# EAGLE design HS(LED CONTROLLER)V1 (EAGLE 8.3.0)
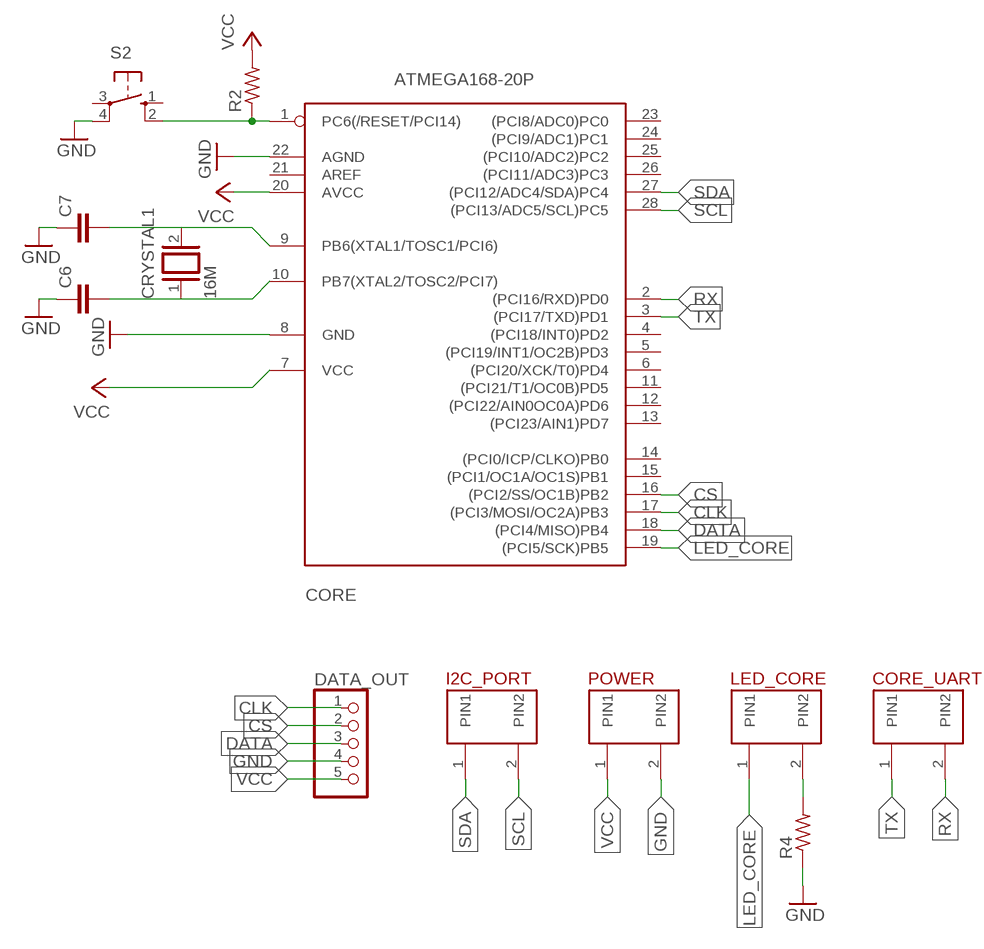
[diagram p0: schematic, sheet 1]

## Parts
C6  C-EU025-024X044  [C025-024X044]
C7  C-EU025-024X044  [C025-024X044]
CORE  ATMEGA168-20P  [DIL28-3]
CORE_UART  7325  [2.54MM]
CRYSTAL1  16M  XTAL/S  [QS]
DATA_OUT  PINHD-1X5/90  [1X05/90]
I2C_PORT  7325  [2.54MM]
LED_CORE  7325  [2.54MM]
POWER  7325  [2.54MM]
R2  R-US_0207/10  [0207/10]
R4  R-US_0207/10  [0207/10]
S2  10-XX  [B3F-10XX]

## Nets
CLK: CORE.17((PCI3/MOSI/OC2A)PB3) DATA_OUT.1
CS: CORE.16((PCI2/SS/OC1B)PB2) DATA_OUT.2
DATA: CORE.18((PCI4/MISO)PB4) DATA_OUT.3
GND: C6.1 C7.1 CORE.8(GND) CORE.22(AGND) DATA_OUT.4 POWER.2(PIN2) R4.1 S2.4(P1)
LED_CORE: CORE.19((PCI5/SCK)PB5) LED_CORE.1(PIN1)
N$5: LED_CORE.2(PIN2) R4.2
N$6: C7.2 CORE.9(PB6(XTAL1/TOSC1/PCI6)) CRYSTAL1.2
N$7: C6.2 CORE.10(PB7(XTAL2/TOSC2/PCI7)) CRYSTAL1.1
N$8: CORE.1(PC6(/RESET/PCI14)) R2.1 S2.2(S1)
RX: CORE.2((PCI16/RXD)PD0) CORE_UART.2(PIN2)
SCL: CORE.28((PCI13/ADC5/SCL)PC5) I2C_PORT.2(PIN2)
SDA: CORE.27((PCI12/ADC4/SDA)PC4) I2C_PORT.1(PIN1)
TX: CORE.3((PCI17/TXD)PD1) CORE_UART.1(PIN1)
VCC: CORE.7(VCC) CORE.20(AVCC) DATA_OUT.5 POWER.1(PIN1) R2.2
Unconnected: CORE.4((PCI18/INT0)PD2) CORE.5((PCI19/INT1/OC2B)PD3) CORE.6((PCI20/XCK/T0)PD4) CORE.11((PCI21/T1/OC0B)PD5) CORE.12((PCI22/AIN0OC0A)PD6) CORE.13((PCI23/AIN1)PD7) CORE.14((PCI0/ICP/CLKO)PB0) CORE.15((PCI1/OC1A/OC1S)PB1) CORE.21(AREF) CORE.23((PCI8/ADC0)PC0) CORE.24((PCI9/ADC1)PC1) CORE.25((PCI10/ADC2)PC2) CORE.26((PCI11/ADC3)PC3) S2.1(S) S2.3(P)

## Library data of the parts
C6 C7 = resistor:C-EU: CAPACITOR, European symbol
CORE = adafruit:ATMEGA168*P: MICROCONTROLLER 16 kBytes FLASH 1 kBytes SRAM 512 Bytes EEPROM USART 8-channel 10 bit ADC
CORE_UART I2C_PORT LED_CORE POWER = pin header:7325
CRYSTAL1 = special:XTAL/S: CRYSTAL
DATA_OUT = pinhead:PINHD-1X5: PIN HEADER
R2 R4 = adafruit:R-US_: RESISTOR, American symbol
S2 = switch-omron:10-XX: OMRON SWITCH; MPN: B3F-1000; OC_FARNELL: 176432; OC_NEWARK: 36M3542

## Net classes
0 default: width 0.15 mm, drill 0.3 mm, clearance 0.15 mm

## Board
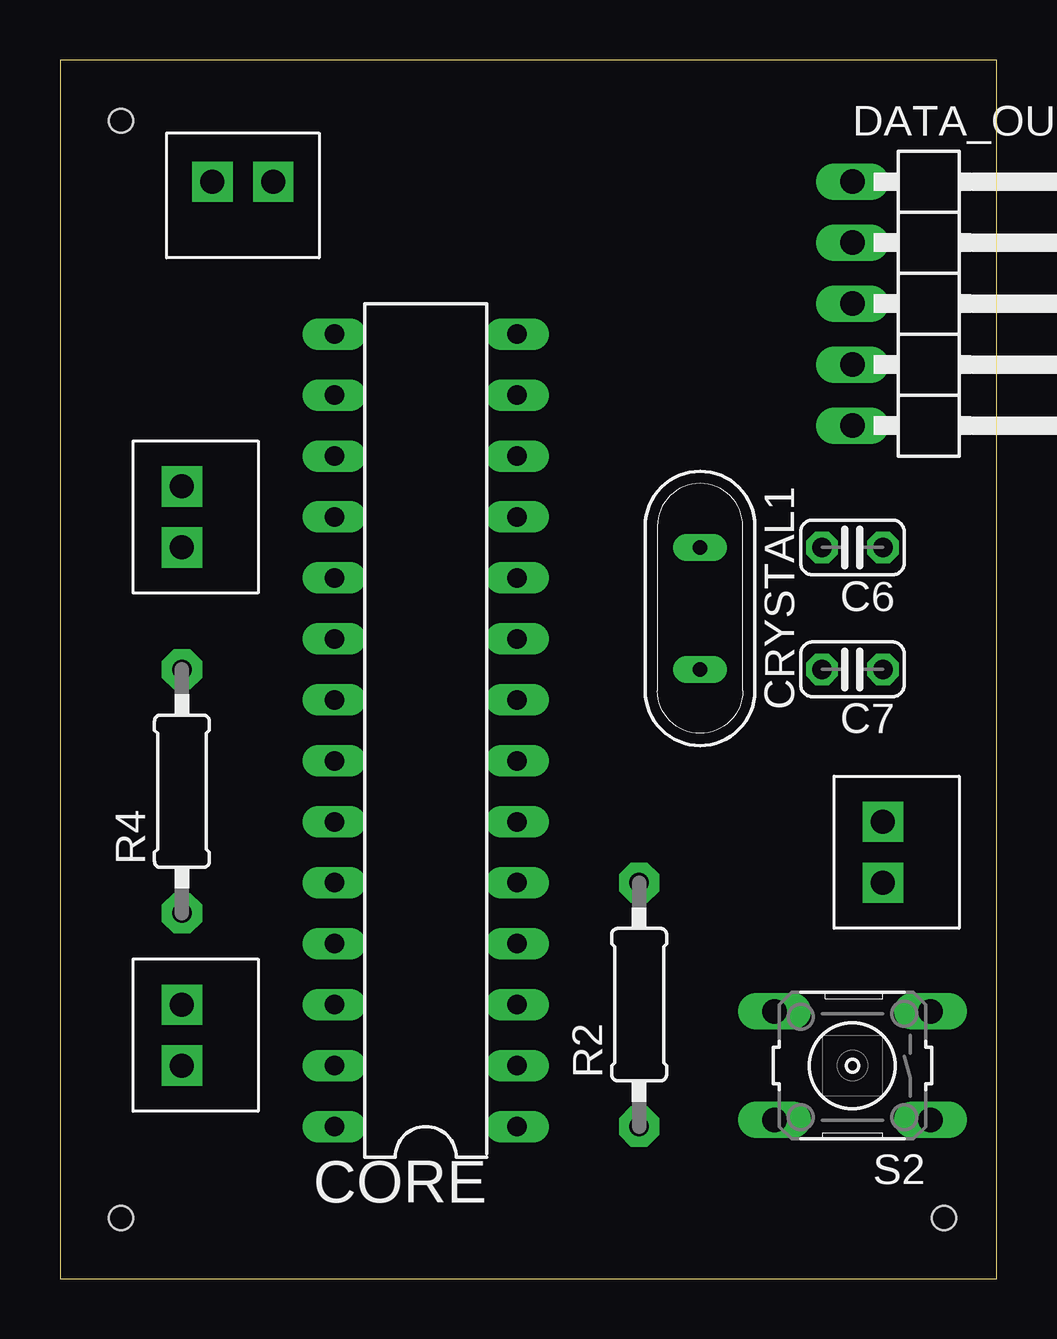
[diagram p1: board, top side]
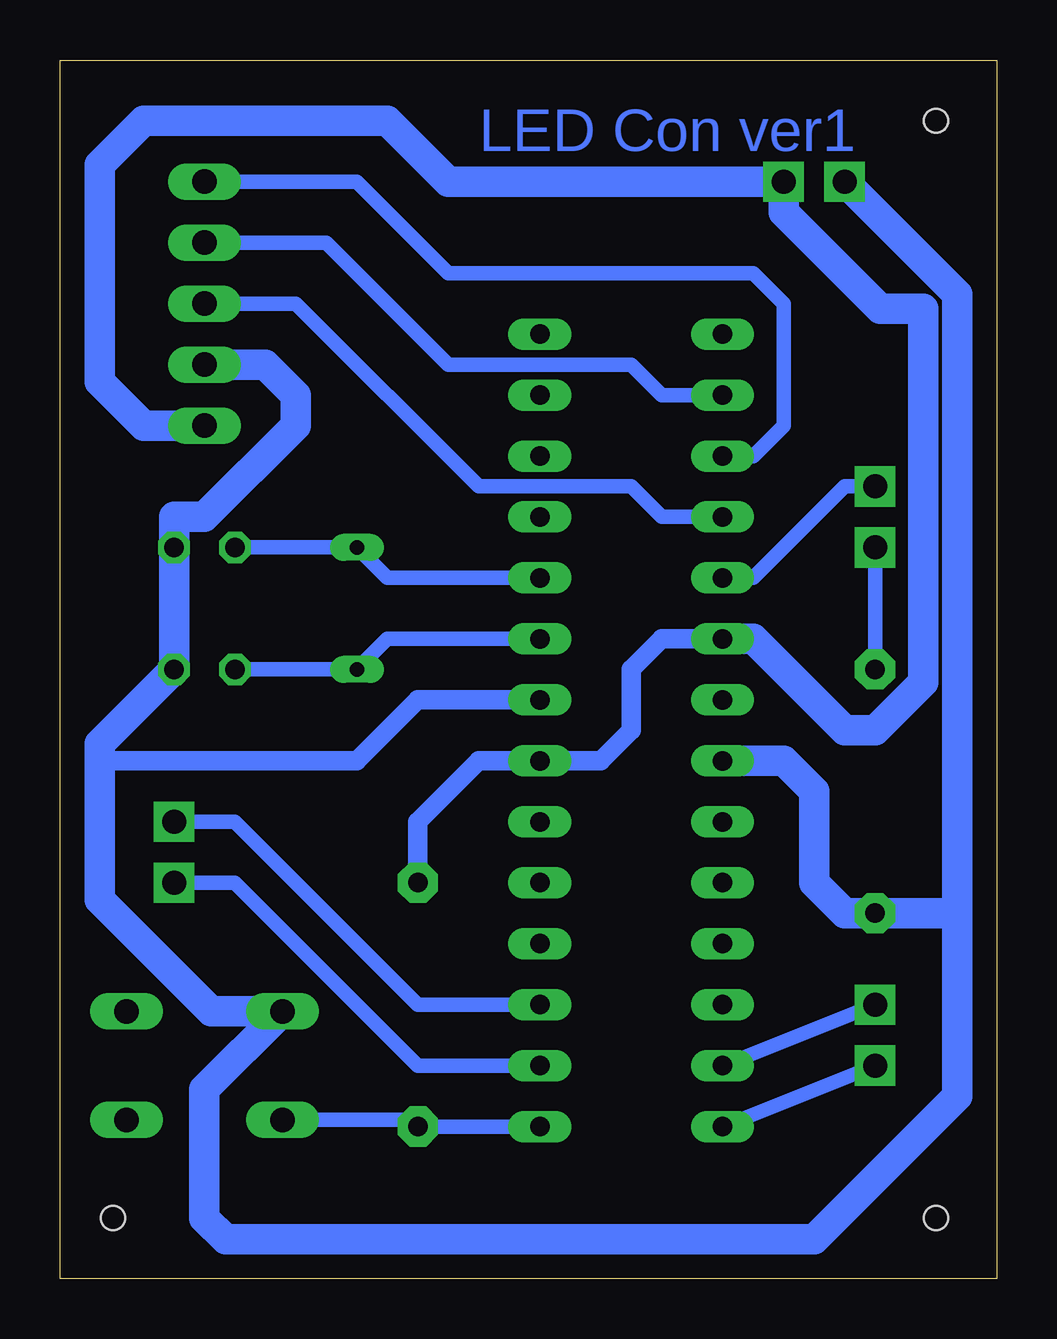
[diagram p2: board, bottom side, seen from below]

Size 39.04 x 50.79 mm. Coordinates in mm from the lower left corner, seen from the top.
Outline: 0,0 39.04,0 39.04,50.79 0,50.79 0,0
Copper layers (1*16): Top 0.035mm / dielectric 1.5mm / Bottom 0.035mm
Design rules "default": minimum track width 6mil, minimum drill 0.35mm, track to track 6mil, track to pad 6mil, pad to pad 6mil, via to via 6mil, smd to smd 6mil, copper to edge 40mil, drill to drill 6mil, minimum pad ring 10mil, minimum via ring 8mil, stop-mask expansion 4mil, vias tented up to drill 0mil, thermal gap 10mil
Holes 1 mm at 36.83,2.54 2.54,48.26 2.54,2.54

### Footprints (pad centres in the part's own frame; a part is rotated, then mirrored left to right if it is on the bottom)
C025-024X044 = drill 0.813 octagon: 1 -1.27,0; 2 1.27,0
DIL28-3 = drill 0.813 long: 1 -16.51,-3.81; 2 -13.97,-3.81; 3 -11.43,-3.81; 4 -8.89,-3.81; 5 -6.35,-3.81; 6 -3.81,-3.81; 7 -1.27,-3.81; 8 1.27,-3.81; 9 3.81,-3.81; 10 6.35,-3.81; 11 8.89,-3.81; 12 11.43,-3.81; 13 13.97,-3.81; 14 16.51,-3.81; 15 16.51,3.81; 16 13.97,3.81; 17 11.43,3.81; 18 8.89,3.81; 19 6.35,3.81; 20 3.81,3.81; 21 1.27,3.81; 22 -1.27,3.81; 23 -3.81,3.81; 24 -6.35,3.81; 25 -8.89,3.81; 26 -11.43,3.81; 27 -13.97,3.81; 28 -16.51,3.81
2.54MM = drill 1 pad 1.676 square: 1 -1.27,0; 2 1.27,0
QS = drill 0.61 long: 1 -2.54,0; 2 2.54,0
1X05/90 = drill 1.016 long: 1 -5.08,-3.81; 2 -2.54,-3.81; 3 0,-3.81; 4 2.54,-3.81; 5 5.08,-3.81
0207/10 = drill 0.813 pad 1.676 octagon: 1 -5.08,0; 2 5.08,0
B3F-10XX = drill 1.016 long: 1 -3.251,2.261; 2 3.251,2.261; 3 -3.251,-2.261; 4 3.251,-2.261

### Placement (x,y rotation side)
C6  33.02,30.48 180 top
C7  33.02,25.4 180 top
CORE  15.24,22.86 90 top
CORE_UART  34.29,17.78 270 top
CRYSTAL1  26.67,27.94 270 top
DATA_OUT  36.83,40.64 270 top
I2C_PORT  5.08,10.16 270 top
LED_CORE  5.08,31.75 270 top
POWER  7.62,45.72 180 top
R2  24.13,11.43 90 top
R4  5.08,20.32 90 top
S2  33.02,8.89 180 top

### Tracks (layer width: path | path; a pad name or v marks a point on that pad's centre or on a via)
CLK
  Bottom 0.61: DATA_OUT.1 26.67,45.72 22.86,41.91 10.16,41.91 8.89,40.64 8.89,35.56 10.16,34.29 CORE.17
CS
  Bottom 0.61: DATA_OUT.2 27.94,43.18 22.86,38.1 15.24,38.1 13.97,36.83 CORE.16
DATA
  Bottom 0.61: DATA_OUT.3 29.21,40.64 21.59,33.02 15.24,33.02 13.97,31.75 CORE.18
GND
  Bottom 0.813: CORE.8 24.13,24.13 26.67,21.59 37.38,21.59 37.39,21.59
  Bottom 1.27: 1.65,15.05 1.65,41.02 POWER.2 | 1.65,15.05 1.84,15.24 R4.1 6.35,15.24 7.62,16.51 7.62,20.32 8.89,21.59 CORE.22 | DATA_OUT.4 30.48,38.1 29.21,36.83 29.21,35.56 33.02,31.75 34.29,31.75 C6.1 C7.1 37.39,22.3 37.39,21.59 37.39,15.8 32.74,11.15 S2.4 33.02,7.9 33.02,2.54 32.13,1.65 7.62,1.65 1.65,7.62 1.65,15.05
LED_CORE
  Bottom 0.61: LED_CORE.1 6.35,33.02 10.16,29.21 CORE.19
N$5
  Bottom 0.61: R4.2 LED_CORE.2
N$6
  Bottom 0.61: C7.2 CRYSTAL1.2 25.4,26.67 CORE.9
N$7
  Bottom 0.61: C6.2 CRYSTAL1.1 25.4,29.21 CORE.10
N$8
  Bottom 0.61: S2.2 24.41,6.63 R2.1 CORE.1
RX
  Bottom 0.61: CORE_UART.2 31.75,16.51 24.13,8.89 CORE.2
SCL
  Bottom 0.61: CORE.28 I2C_PORT.2
SDA
  Bottom 0.61: I2C_PORT.1 CORE.27
TX
  Bottom 0.61: CORE.3 24.13,11.43 31.75,19.05 CORE_UART.1
VCC
  Bottom 0.813: R2.2 24.13,19.05 21.59,21.59 CORE.7 16.51,21.59 15.24,22.86 15.24,25.4 13.97,26.67 CORE.20
  Bottom 1.27: CORE.20 10.16,26.67 6.35,22.86 5.08,22.86 3.07,24.87 3.07,40.43 4.87,40.43 8.89,44.45 POWER.1 22.86,45.72 25.4,48.26 35.56,48.26 37.39,46.43 37.39,37.39 35.56,35.56 DATA_OUT.5

### Text on the board
Bottom: LED Con ver1